# EAGLE design RC2014_UX_MODULE (EAGLE 6.6.0)
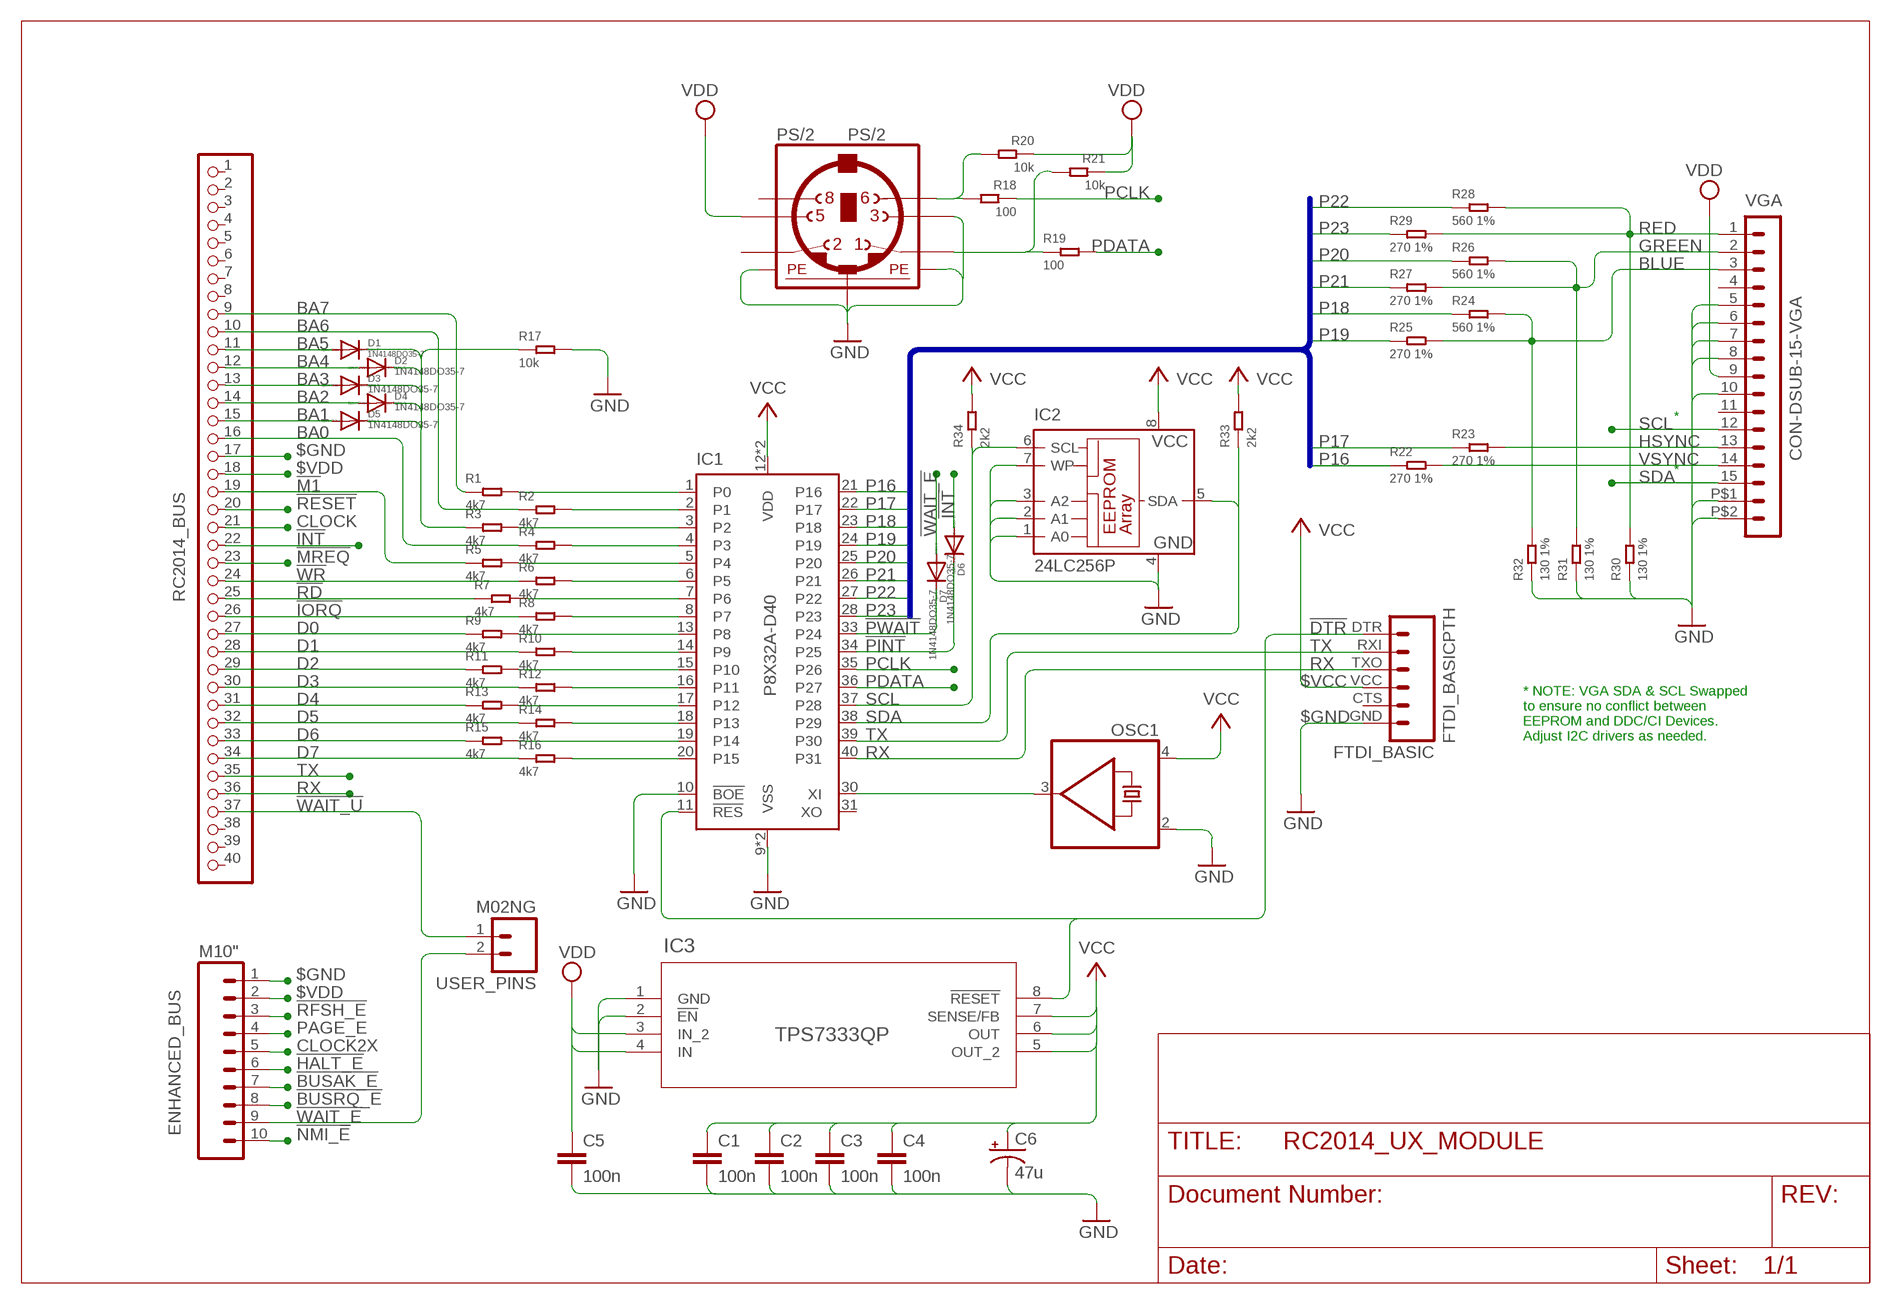
[diagram p0: schematic, sheet 1]

## Parts
C1  100n  C-EU025-025X050  [C025-025X050]
C2  100n  C-EU025-025X050  [C025-025X050]
C3  100n  C-EU025-025X050  [C025-025X050]
C4  100n  C-EU025-025X050  [C025-025X050]
C5  100n  C-EU025-025X050  [C025-025X050]
C6  47u  CAP_POLPTH1  [CPOL-RADIAL-100UF-25V]
D1  1N4148DO35-7  [DO35-7]
D2  1N4148DO35-7  [DO35-7]
D3  1N4148DO35-7  [DO35-7]
D4  1N4148DO35-7  [DO35-7]
D5  1N4148DO35-7  [DO35-7]
D6  1N4148DO35-7  [DO35-7]
D7  1N4148DO35-7  [DO35-7]
ENHANCED_BUS  M10"  [1X10]
FTDI_BASIC  FTDI_BASICPTH  [FTDI_BASIC]
IC1  P8X32A-D40  [DIL40]
IC2  24LC256P  [DIL8]
IC3  TPS7333QP  [P8_TEX]
OSC1  SG531  [DIL08-4]
PS/2  PS/2  MINI_DIN_6  [M_DIN6]
R1  4k7  RES-0207/7  [R0207_7]
R2  4k7  RES-0207/7  [R0207_7]
R3  4k7  RES-0207/7  [R0207_7]
R4  4k7  RES-0207/7  [R0207_7]
R5  4k7  RES-0207/7  [R0207_7]
R6  4k7  RES-0207/7  [R0207_7]
R7  4k7  RES-0207/7  [R0207_7]
R8  4k7  RES-0207/7  [R0207_7]
R9  4k7  RES-0207/7  [R0207_7]
R10  4k7  RES-0207/7  [R0207_7]
R11  4k7  RES-0207/7  [R0207_7]
R12  4k7  RES-0207/7  [R0207_7]
R13  4k7  RES-0207/7  [R0207_7]
R14  4k7  RES-0207/7  [R0207_7]
R15  4k7  RES-0207/7  [R0207_7]
R16  4k7  RES-0207/7  [R0207_7]
R17  10k  RES-0207/7  [R0207_7]
R18  100  RES-0207/7  [R0207_7]
R19  100  RES-0207/7  [R0207_7]
R20  10k  RES-0207/7  [R0207_7]
R21  10k  RES-0207/7  [R0207_7]
R22  270 1%  RES-0207/7  [R0207_7]
R23  270 1%  RES-0207/7  [R0207_7]
R24  560 1%  RES-0207/7  [R0207_7]
R25  270 1%  RES-0207/7  [R0207_7]
R26  560 1%  RES-0207/7  [R0207_7]
R27  270 1%  RES-0207/7  [R0207_7]
R28  560 1%  RES-0207/7  [R0207_7]
R29  270 1%  RES-0207/7  [R0207_7]
R30  130 1%  RES-0207/7  [R0207_7]
R31  130 1%  RES-0207/7  [R0207_7]
R32  130 1%  RES-0207/7  [R0207_7]
R33  2k2  RES-0207/7  [R0207_7]
R34  2k2  RES-0207/7  [R0207_7]
RC2014_BUS  RC2014 BUS  PINHD-1X40  [1X40]
USER_PINS  M02NG  [1X02]
VGA  CON-DSUB-15-VGA  [181-015-212-171]

## Nets
!BUSAK_E: ENHANCED_BUS.7
!BUSRQ_E: ENHANCED_BUS.8
!DTR: FTDI_BASIC.DTR IC1.11(!RES) IC3.8(!RESET)
!HALT_E: ENHANCED_BUS.6
!INT: D6.A RC2014_BUS.22
!IORQ: R8.1 RC2014_BUS.26
!M1: R5.1 RC2014_BUS.19
!MREQ: RC2014_BUS.23
!NMI_E: ENHANCED_BUS.10
!PINT: D6.C IC1.34(P25)
!PWAIT: D7.C IC1.33(P24)
!RD: R7.1 RC2014_BUS.25
!RESET: RC2014_BUS.20
!RFSH_E: ENHANCED_BUS.3
!WAIT_E: D7.A ENHANCED_BUS.9 USER_PINS.2
!WAIT_U: RC2014_BUS.37 USER_PINS.1
!WR: R6.1 RC2014_BUS.24
$GND: C1.2 C2.2 C3.2 C4.2 C5.2 C6.2(-) ENHANCED_BUS.1 FTDI_BASIC.GND IC1.9(VSS) IC1.10(!BOE) IC1.29(VSS) IC2.1(A0) IC2.2(A1) IC2.3(A2) IC2.4(GND) IC2.7(WP) IC3.1(GND) IC3.2(!EN) OSC1.2(GND) PS/2.3 PS/2.SH1(PE1) PS/2.SH2(PE2) PS/2.SH3(PE3) R17.2 R30.1 R31.1 R32.1 RC2014_BUS.17 VGA.5 VGA.6 VGA.7 VGA.8 VGA.10 VGA.P$1 VGA.P$2 ; supply symbol labelled GND
$VCC: C1.1 C2.1 C3.1 C4.1 C6.1(+) FTDI_BASIC.VCC IC1.12(VDD) IC1.32(VDD) IC2.8(VCC) IC3.5(OUT_2) IC3.6(OUT) IC3.7(SENSE/FB) OSC1.4(VCC) R33.2 R34.2 ; supply symbol labelled VCC
$VDD: C5.1 ENHANCED_BUS.2 IC3.3(IN_2) IC3.4(IN) PS/2.5 R20.1 R21.1 RC2014_BUS.18 VGA.9 ; supply symbol labelled VDD
BA0: R4.1 RC2014_BUS.16
BA1: D5.A RC2014_BUS.15
BA2: D4.A RC2014_BUS.14
BA3: D3.A RC2014_BUS.13
BA4: D2.A RC2014_BUS.12
BA5: D1.A RC2014_BUS.11
BA6: R2.1 RC2014_BUS.10
BA7: R1.1 RC2014_BUS.9
BLUE: R24.2 R25.2 R32.2 VGA.3
CLOCK: RC2014_BUS.21
CLOCK2X: ENHANCED_BUS.5
D0: R9.1 RC2014_BUS.27
D1: R10.1 RC2014_BUS.28
D2: R11.1 RC2014_BUS.29
D3: R12.1 RC2014_BUS.30
D4: R13.1 RC2014_BUS.31
D5: R14.1 RC2014_BUS.32
D6: R15.1 RC2014_BUS.33
D7: R16.1 RC2014_BUS.34
GREEN: R26.2 R27.2 R31.2 VGA.2
HSYNC: R23.2 VGA.13
KCLK: PS/2.6 R18.2 R20.2
KDATA: PS/2.1 R19.1 R21.2
N$1: IC1.13(P8) R9.2
N$2: IC1.14(P9) R10.2
N$3: IC1.15(P10) R11.2
N$4: IC1.16(P11) R12.2
N$5: IC1.17(P12) R13.2
N$6: IC1.18(P13) R14.2
N$7: IC1.19(P14) R15.2
N$8: IC1.20(P15) R16.2
N$9: IC1.8(P7) R8.2
N$10: IC1.7(P6) R7.2
N$11: IC1.6(P5) R6.2
N$12: IC1.5(P4) R5.2
N$13: IC1.4(P3) R4.2
N$14: IC1.3(P2) R3.2
N$15: IC1.2(P1) R2.2
N$16: IC1.1(P0) R1.2
N$19: D1.C D2.C D3.C D4.C D5.C R3.1 R17.1
N$20: IC1.30(XI) OSC1.3(OUT)
P16: IC1.21(P16) R22.1
P17: IC1.22(P17) R23.1
P18: IC1.23(P18) R24.1
P19: IC1.24(P19) R25.1
P20: IC1.25(P20) R26.1
P21: IC1.26(P21) R27.1
P22: IC1.27(P22) R28.1
P23: IC1.28(P23) R29.1
PAGE_E: ENHANCED_BUS.4
PCLK: IC1.35(P26) R18.1
PDATA: IC1.36(P27) R19.2
RED: R28.2 R29.2 R30.2 VGA.1
RX: FTDI_BASIC.TXO IC1.40(P31) RC2014_BUS.36
SCL: IC1.37(P28) IC2.6(SCL) R34.1 VGA.12
SDA: IC1.38(P29) IC2.5(SDA) R33.1 VGA.15
TX: FTDI_BASIC.RXI IC1.39(P30) RC2014_BUS.35
VSYNC: R22.2 VGA.14
Unconnected: FTDI_BASIC.CTS IC1.31(XO) PS/2.2 PS/2.8 RC2014_BUS.1 RC2014_BUS.2 RC2014_BUS.3 RC2014_BUS.4 RC2014_BUS.5 RC2014_BUS.6 RC2014_BUS.7 RC2014_BUS.8 RC2014_BUS.38 RC2014_BUS.39 RC2014_BUS.40 VGA.4 VGA.11

## Buses
P16,P17,P18,P19,P20,P21,P22,P23

## Notes on the sheet
- *
- *
- * NOTE: VGA SDA & SCL Swapped
  to ensure no conflict between
  EEPROM and DDC/CI Devices.
  Adjust I2C drivers as needed.

## Library data of the parts
C1-C5 = rcl:C-EU: CAPACITOR, European symbol
C6 = SparkFun:CAP_POL: Capacitor Polarized These are standard SMD and PTH capacitors. Normally 10uF, 47uF, and 100uF in electrolytic and tantalum varieties. Always verify the external diameter of the through hole cap, it varies with capacity, voltage, and manufacturer. The EIA devices should be standard.
D1-D7 = diode:1N4148: DIODE high speed (Philips)
ENHANCED_BUS = SparkFun:M10: Header 10 Standard 10-pin 0.1" header. Use with straight break away headers (SKU : PRT-00116), right angle break away headers (PRT-00553), swiss pins (PRT-00743), machine pins (PRT-00117), and female headers (PRT-00115).
FTDI_BASIC = SparkFun:FTDI_BASIC: FTDI Basic: 3.3V and 5V
IC1 = p8x32a_11:P8X32A-?: 8-Cog Multiprocessor Microcontroller Source: http://www.parallax.com/sites/default/files/downloads/P8X32A-Propeller-Datasheet-v1.4.0_0.pdf; MF: Parallax Semiconductor; MPN: P8X32A-D40; OC_FARNELL: 1263886; OC_NEWARK: 11X5686
IC2 = microchip:24*: Serial EEPROM I2C; MF: MICROCHIP; MPN: 24LC256-E/P; OC_FARNELL: 9757970; OC_NEWARK: 92C7169
IC3 = TPS7333:TPS7333QP; BUILT_BY: EMA_UL_Team; MANUFACTURER: Texas Instruments; MANUFACTURER_PART_NUMBER: TPS7333QP; SOURCELIBRARY: TI_2016-07-22; VENDOR: Texas Instruments
OSC1 = FX-Z180 Rev A:SG531: CRYSTAL RESONATOR
PS/2 = mini_din:MINI_DIN_6
R1-R34 = Seeed-OPL-Resistor-V2:RES
RC2014_BUS = pinhead:PINHD-1X40: PIN HEADER
USER_PINS = SparkFun:M02NG
VGA = m-pad-2.1:CON-DSUB-15-VGA: NORCOMP's High Density 90° PC Mount D-Sub Connector 181 Series: SPECIFICATIONS: Contact Rating: 5 Amps Dielectric Strength: 1000V AC RMS Insulation Resistance: 1000 meg ohms Contact Material: Phosphor Bronze Contact Finish: Gold flash over Nickel Operating Temperature: -55°C to 150°C Shell Material: Steel, Tin Plated Insulations Material: Glass-Filled Polyester (UL94V-0) Gender: Receptacle (female) Please send any comments to: messi@users.sourceforge.net

## Board
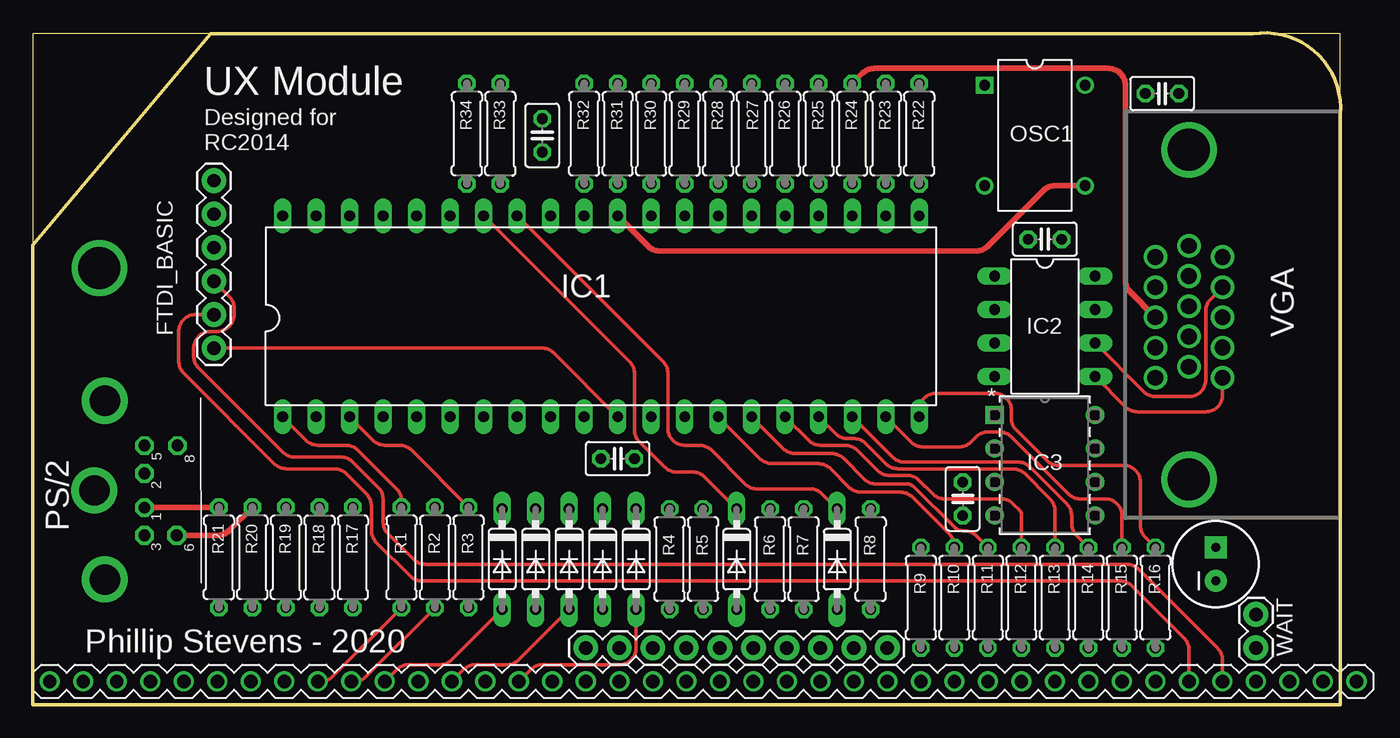
[diagram p1: board, top side]
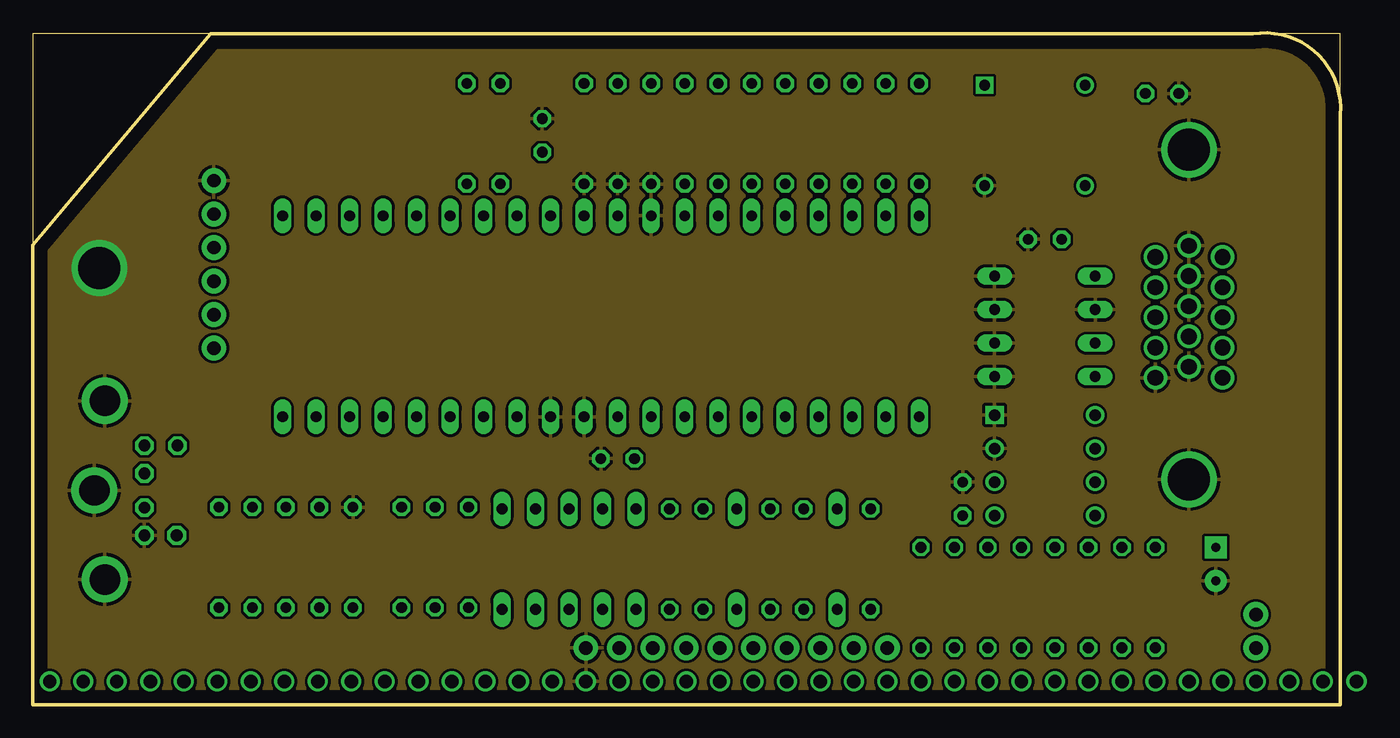
[diagram p2: board, inner layer GND]
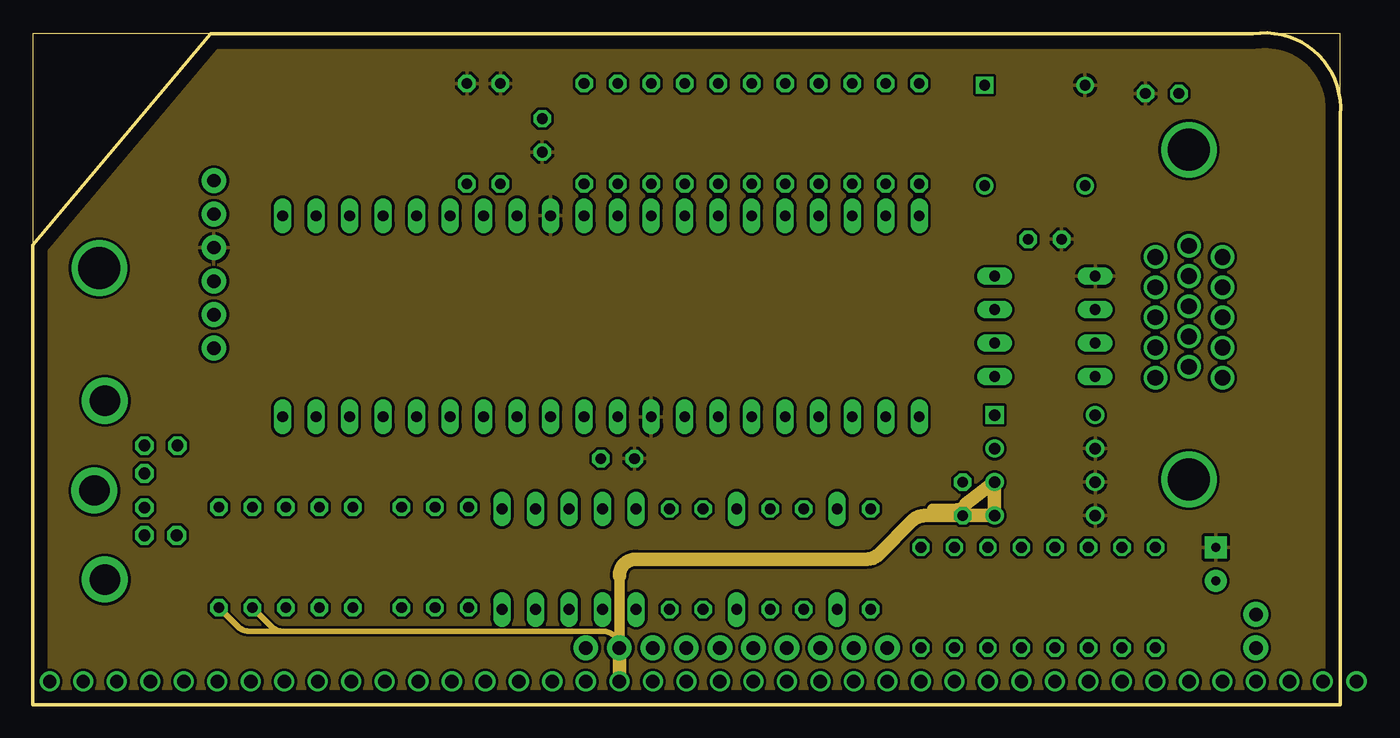
[diagram p3: board, inner layer VCC]
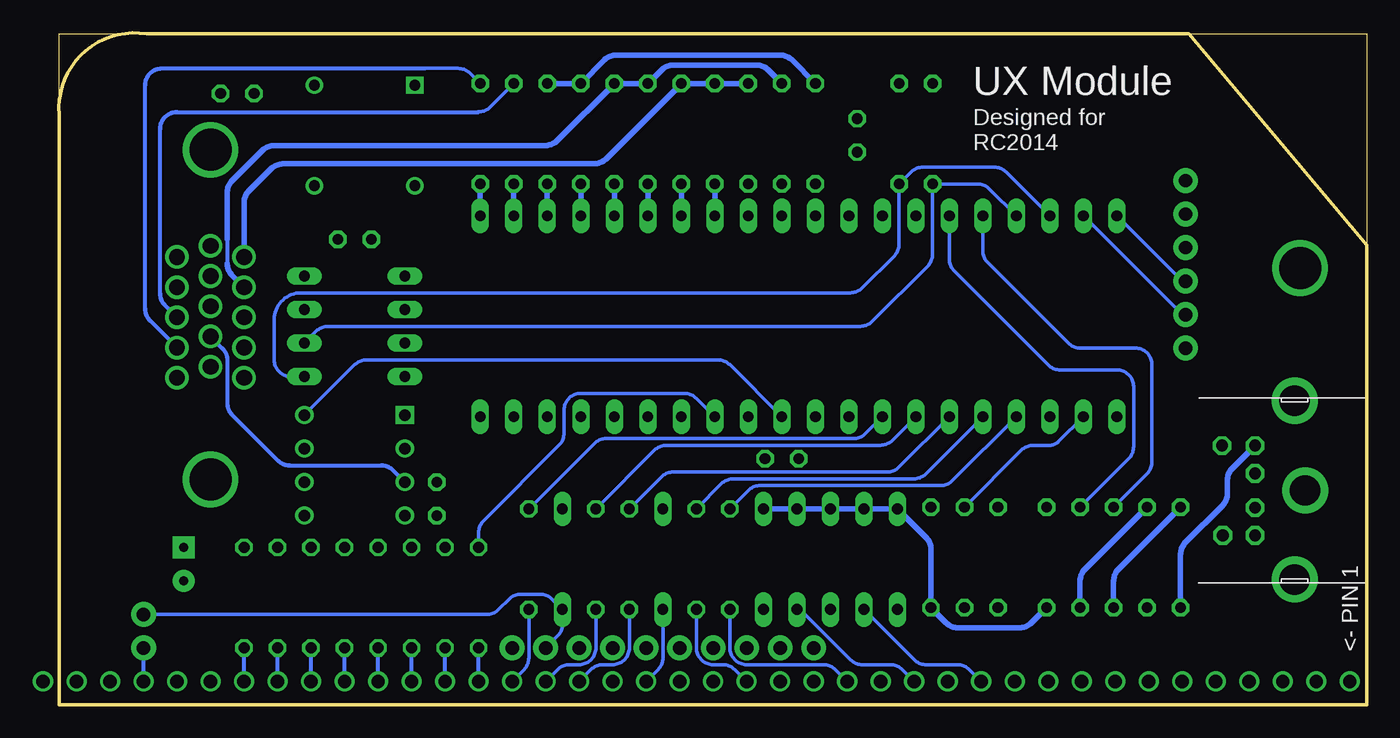
[diagram p4: board, bottom side, seen from below]

Size 99.13 x 50.95 mm. Coordinates in mm from the lower left corner, seen from the top.
Outline: 99.11,44.76 99.11,50.88 92.48,50.88
Outline: 13.49,50.88 0,50.88 0,34.85
Outline: 0,34.85 13.49,50.88
Outline: 92.48,50.88 arc-104 99.11,44.76
Outline: 13.49,50.88 92.48,50.88
Outline: 99.11,44.76 99.11,0 0,0 0,34.85
Copper layers (1*2*15*16): Top 0.035mm / dielectric 0.3mm / GND 0.035mm / dielectric 0.3mm / VCC 0.035mm / dielectric 0.3mm / Bottom 0.035mm
Design rules "default *": minimum track width 10mil, minimum drill 24mil, track to track 8mil, track to pad 8mil, pad to pad 8mil, via to via 8mil, smd to smd 8mil, copper to edge 40mil, drill to drill 8mil, minimum pad ring 10mil, minimum via ring 8mil, stop-mask expansion 4mil, vias tented up to drill 0mil, thermal gap 10mil

### Footprints (pad centres in the part's own frame; a part is rotated, then mirrored left to right if it is on the bottom)
C025-025X050 = drill 0.813 octagon: 1 -1.27,0; 2 1.27,0
CPOL-RADIAL-100UF-25V = drill 0.7 pad 1.651 square: 1 1.27,0 | drill 0.7 pad 1.651: 2 -1.27,0
DO35-7 = drill 0.813 long: A 3.81,0; C -3.81,0
1X10 = drill 1.016 pad 1.88: 1 0,0; 2 2.54,0; 3 5.08,0; 4 7.62,0; 5 10.16,0; 6 12.7,0; 7 15.24,0; 8 17.78,0; 9 20.32,0; 10 22.86,0
FTDI_BASIC = drill 1.016 pad 1.88: CTS 10.16,0; DTR 0,0; GND 12.7,0; RXI 2.54,0; TXO 5.08,0; VCC 7.62,0
DIL40 = drill 0.813 long: 1 -22.86,-7.62; 2 -20.32,-7.62; 3 -17.78,-7.62; 4 -15.24,-7.62; 5 -12.7,-7.62; 6 -10.16,-7.62; 7 -7.62,-7.62; 8 -5.08,-7.62; 9 -2.54,-7.62; 10 0,-7.62; 11 2.54,-7.62; 12 5.08,-7.62; 13 7.62,-7.62; 14 10.16,-7.62; 15 12.7,-7.62; 16 15.24,-7.62; 17 17.78,-7.62; 18 20.32,-7.62; 19 22.86,-7.62; 20 25.4,-7.62; 21 25.4,7.62; 22 22.86,7.62; 23 20.32,7.62; 24 17.78,7.62; 25 15.24,7.62; 26 12.7,7.62; 27 10.16,7.62; 28 7.62,7.62; 29 5.08,7.62; 30 2.54,7.62; 31 0,7.62; 32 -2.54,7.62; 33 -5.08,7.62; 34 -7.62,7.62; 35 -10.16,7.62; 36 -12.7,7.62; 37 -15.24,7.62; 38 -17.78,7.62; 39 -20.32,7.62; 40 -22.86,7.62
DIL8 = drill 0.813 long: 1 -3.81,-3.81; 2 -1.27,-3.81; 3 1.27,-3.81; 4 3.81,-3.81; 5 3.81,3.81; 6 1.27,3.81; 7 -1.27,3.81; 8 -3.81,3.81
P8_TEX = drill 0.864 pad 1.372 square: 1 0,0 | drill 0.864 pad 1.372: 2 0,-2.54; 3 0,-5.08; 4 0,-7.62; 5 7.62,-7.62; 6 7.62,-5.08; 7 7.62,-2.54; 8 7.62,0
DIL08-4 = drill 0.813 square: 1 -3.81,-3.81 | drill 0.813: 2 3.81,-3.81; 3 3.81,3.81; 4 -3.81,3.81
M_DIN6 = drill 0.9 pad 1.422 octagon: 1 -1.3,-3.75; 2 1.3,-3.75; 3 -3.4,-3.75; 5 3.4,-3.75; 6 -3.4,-6.2; 8 3.4,-6.25 | drill 2.3 pad 3.5: SH1 6.8,-0.75; SH2 0,0.05; SH3 -6.75,-0.75
R0207_7 = drill 0.813 octagon: 1 -3.81,0; 2 3.81,0
1X40 = drill 1.016: 1 -49.53,0; 2 -46.99,0; 3 -44.45,0; 4 -41.91,0; 5 -39.37,0; 6 -36.83,0; 7 -34.29,0; 8 -31.75,0; 9 -29.21,0; 10 -26.67,0; 11 -24.13,0; 12 -21.59,0; 13 -19.05,0; 14 -16.51,0; 15 -13.97,0; 16 -11.43,0; 17 -8.89,0; 18 -6.35,0; 19 -3.81,0; 20 -1.27,0; 21 1.27,0; 22 3.81,0; 23 6.35,0; 24 8.89,0; 25 11.43,0; 26 13.97,0; 27 16.51,0; 28 19.05,0; 29 21.59,0; 30 24.13,0; 31 26.67,0; 32 29.21,0; 33 31.75,0; 34 34.29,0; 35 36.83,0; 36 39.37,0; 37 41.91,0; 38 44.45,0; 39 46.99,0; 40 49.53,0
1X02 = drill 1.016 pad 1.88: 1 0,0; 2 2.54,0
181-015-212-171 = drill 1.194: 1 4.371,2.541; 2 2.08,2.541; 3 -0.211,2.541; 4 -2.502,2.541; 5 -4.793,2.541; 6 5.217,0; 7 2.926,0; 8 0.635,0; 9 -1.656,0; 10 -3.947,0; 11 4.371,-2.541; 12 2.08,-2.541; 13 -0.211,-2.541; 14 -2.502,-2.541; 15 -4.793,-2.541 | drill 3.2: P$1 -12.502,0; P$2 12.502,0

### Placement (x,y rotation side)
C1  44.32,18.67 180 top
C2  38.61,43.18 90 top
C3  76.71,35.31 180 top
C4  85.6,46.35 0 top
C5  70.48,15.62 90 top
C6  89.66,10.67 90 top
D1  35.56,11.05 270 top
D2  38.1,11.05 270 top
D3  40.64,11.05 270 top
D4  43.18,11.05 270 top
D5  45.72,11.05 270 top
D6  53.34,11.05 270 top
D7  60.96,11.05 270 top
ENHANCED_BUS  41.91,4.32 0 top
FTDI_BASIC  13.72,27.05 90 top
IC1  41.78,29.46 0 top
IC2  76.71,28.7 270 top
IC3  72.9,21.97 0 top
OSC1  75.95,43.18 270 top
PS/2  4.7,16.26 90 top
R1  27.94,11.18 90 top
R2  30.48,11.18 90 top
R3  33.02,11.18 90 top
R4  48.26,11.05 90 top
R5  50.8,11.05 90 top
R6  55.88,11.05 90 top
R7  58.42,11.05 90 top
R8  63.5,11.05 90 top
R9  67.31,8.13 90 top
R10  69.85,8.13 90 top
R11  72.39,8.13 90 top
R12  74.93,8.13 90 top
R13  77.47,8.13 90 top
R14  80.01,8.13 90 top
R15  82.55,8.13 90 top
R16  85.09,8.13 90 top
R17  24.26,11.18 90 top
R18  21.72,11.18 270 top
R19  19.18,11.18 90 top
R20  16.64,11.18 90 top
R21  14.1,11.18 90 top
R22  67.18,43.31 90 top
R23  64.64,43.31 90 top
R24  62.1,43.31 90 top
R25  59.56,43.31 90 top
R26  57.02,43.31 90 top
R27  54.48,43.31 90 top
R28  51.94,43.31 90 top
R29  49.4,43.31 90 top
R30  46.86,43.31 90 top
R31  44.32,43.31 90 top
R32  41.78,43.31 90 top
R33  35.43,43.31 90 top
R34  32.89,43.31 90 top
RC2014_BUS  50.8,1.78 0 top
USER_PINS  92.71,4.32 90 top
VGA  87.63,29.59 90 top

### Tracks (layer width: path | path; a pad name or v marks a point on that pad's centre or on a via)
!DTR
  Top 0.254: FTDI_BASIC.DTR 38.59,27.05 arc-45 39.49,26.68 IC1.11
  Bottom 0.254: IC3.8 76.7,25.79 arc45 75.8,26.16 49.17,26.16 arc45 48.27,25.79 IC1.11
!INT
  Bottom 0.254: D6.A 53.34,3.57 arc45 53.71,2.68 RC2014_BUS.22
!IORQ
  Bottom 0.254: R8.1 63.5,3.57 arc45 63.87,2.68 RC2014_BUS.26
!M1
  Bottom 0.254: R5.1 50.8,4.32 arc-90 49.53,3.05 48.79,3.05 arc45 47.89,2.68 RC2014_BUS.19
!PINT
  Top 0.254: D6.C 50.92,17.28 arc45 50.02,17.65 48.79,17.65 arc-45 47.89,18.02 45.97,19.95 arc-45 45.59,20.85 45.59,25.13 arc45 45.22,26.03 IC1.34
!PWAIT
  Top 0.254: D7.C 59.81,16.01 arc45 58.91,16.38 54.88,16.38 arc-45 53.98,16.75 51.43,19.31 arc45 50.53,19.68 49.4,19.68 arc-90 48.13,20.95 48.13,25.13 arc45 47.76,26.03 IC1.33
!RD
  Bottom 0.254: R7.1 58.42,4.32 arc90 59.69,3.05 60.43,3.05 arc-45 61.33,2.68 RC2014_BUS.25
!WAIT_E
  Bottom 0.254: ENHANCED_BUS.9 61.33,5.22 arc-45 60.96,6.11 D7.A 61.73,8.01 arc-45 62.63,8.38 64.12,8.38 arc-45 65.02,8.01 65.8,7.23 arc45 66.69,6.86 USER_PINS.2
!WAIT_U
  Bottom 0.305: RC2014_BUS.37 USER_PINS.1
!WR
  Bottom 0.254: R6.1 55.88,4.32 arc90 57.15,3.05 57.91,3.05 arc-45 58.78,2.69 RC2014_BUS.24
$GND  (via drill 3.2)
  other vias: 5.03,33.12
  pour GND: 13.46,50.8 92.58,50.93 arc-90 99.06,45.72 99.06,0 0,0 0,34.92
$VCC
  pour VCC: 13.46,50.93 93.34,50.93 arc-90 99.06,45.72 99.06,0 0,0 0,34.92
$VDD
  VCC 0.406: 18.94,5.59 16.4,5.59 arc-45 15.5,5.96 R21.1 | 18.94,5.59 43.18,5.59 arc-90 ENHANCED_BUS.2 | R20.1 18.04,5.96 arc45 18.94,5.59
  VCC 0.813: ENHANCED_BUS.2 44.45,9.78 | 70.73,15.23 arc-45 69.83,14.86 68.2,14.86 68.33,14.72 arc45 69.23,14.35 C5.1
  VCC 1.016: RC2014_BUS.18 ENHANCED_BUS.2 | 44.45,9.78 arc-90 45.72,11.05 63.23,11.05 arc45 64.13,11.42 66.68,13.98 arc-45 67.58,14.35 C5.1 IC3.4 IC3.3 70.73,15.23
  Bottom 0.305: VGA.9 86.73,27.04 arc45 86.36,26.14 86.36,22.88 arc-45 85.99,21.98 82.54,18.53 arc-45 81.64,18.16 74.69,18.16 arc45 73.8,17.79 IC3.3
  Bottom 0.406: R21.1 14.1,11.41 arc45 13.72,12.31 10.91,15.12 arc-45 10.54,16.02 10.54,17.04 arc45 10.17,17.94 PS/2.5
BA0
  Bottom 0.254: R4.1 48.26,4.32 arc-90 46.99,3.05 41.17,3.05 arc45 40.27,2.68 RC2014_BUS.16
BA1
  Top 0.254: D5.A 45.72,4.32 arc-90 44.45,3.05 38.63,3.05 arc45 37.73,2.68 RC2014_BUS.15
BA2
  Bottom 0.254: RC2014_BUS.14 35.19,2.68 arc-45 36.09,3.05 38.21,3.05 arc45 39.11,3.42 42.75,7.06 arc-45 D4.A
BA3
  Top 0.254: D3.A 36.82,3.42 arc-45 35.92,3.05 33.53,3.05 arc45 32.66,2.69 RC2014_BUS.13
BA4
  Bottom 0.254: D2.A 34.28,3.42 arc-45 33.38,3.05 31.01,3.05 arc45 30.11,2.68 RC2014_BUS.12
BA5
  Top 0.254: D1.A 31.74,3.42 arc-45 30.84,3.05 28.47,3.05 arc45 27.57,2.68 RC2014_BUS.11
BA6
  Top 0.254: R2.1 25.26,2.15 arc-45 24.37,1.78 RC2014_BUS.10
BA7
  Top 0.254: R1.1 22.72,2.15 arc-45 21.83,1.78 RC2014_BUS.9
BLUE
  Top 0.406: VGA.3 83.18,31.29 arc-45 82.8,32.19 82.8,46.99 arc90 81.53,48.26 63.77,48.26 arc45 62.87,47.89 R24.2
  Bottom 0.406: R24.2 R25.2 57.78,48.9 arc45 56.88,49.28 44.47,49.28 arc45 43.57,48.9 R32.2
D0
  Bottom 0.305: RC2014_BUS.27 R9.1
D1
  Bottom 0.305: RC2014_BUS.28 R10.1
D2
  Bottom 0.305: RC2014_BUS.29 R11.1
D3
  Bottom 0.305: RC2014_BUS.30 R12.1
D4
  Bottom 0.305: RC2014_BUS.31 R13.1
D5
  Bottom 0.305: RC2014_BUS.32 R14.1
D6
  Bottom 0.305: RC2014_BUS.33 R15.1
D7
  Bottom 0.305: RC2014_BUS.34 R16.1
GREEN
  Bottom 0.305: 86.36,35.31 86.36,33.47
  Bottom 0.406: VGA.2 85.99,32.57 arc45 86.36,33.47 | 86.36,35.31 86.36,38.84 arc45 85.99,39.74 83.68,42.05 arc45 82.79,42.42 62.25,42.42 arc-45 61.35,42.79 R26.2 R27.2 53.46,48.14 arc45 52.56,48.51 46.25,48.51 arc45 45.35,48.14 R31.2
HSYNC
  Bottom 0.254: 67.33,44.96 arc-45 66.43,45.33 R23.2
  Bottom 0.305: VGA.13 91.07,30.28 arc45 91.44,31.18 91.44,43.69 arc90 90.17,44.96 67.33,44.96
KCLK
  Top 0.406: R20.2 14.88,13.23 arc-45 13.98,12.86 PS/2.6
  Bottom 0.406: R18.2 21.72,9.38 arc45 21.34,10.28 R20.2
KDATA
  Top 0.406: R21.2 arc-45 14.03,14.96 PS/2.1
  Bottom 0.406: R19.1 19.18,9.38 arc45 18.8,10.28 R21.2
N$1
  Bottom 0.254: R9.2 67.31,13.06 arc45 66.94,13.96 61.2,19.69 arc-45 60.83,20.59 60.83,22.35 arc90 59.56,23.62 51.71,23.62 arc45 50.81,23.25 IC1.13
N$2
  Top 0.254: R10.2 69.85,12.05 arc45 69.48,12.95 66.67,15.76 arc45 65.77,16.13 62.76,16.13 arc-45 61.86,16.5 60.44,17.92 arc45 59.55,18.29 56.02,18.29 arc-45 55.13,18.66 IC1.14
N$3
  Top 0.254: R11.2 71.49,12.84 arc45 70.59,13.21 70.48,13.21 arc-45 69.83,13.48 66.79,16.52 arc45 66.2,16.76 63.9,16.76 arc-45 63,17.14 61.46,18.68 arc45 60.56,19.05 57.8,19.05 arc-45 56.91,19.42 IC1.15
N$4
  Top 0.254: R12.2 74.93,14.43 arc45 74.8,14.73 74.29,15.25 arc45 73.39,15.62 69.11,15.62 arc-45 68.21,15.99 67.17,17.03 arc45 66.28,17.4 64.92,17.4 arc-45 64.02,17.77 62.48,19.31 arc45 61.58,19.68 59.69,19.68 arc-45 58.82,20.04 IC1.16
N$5
  Top 0.254: R13.2 77.47,14.71 arc45 77.1,15.61 75.17,17.54 arc45 74.28,17.91 65.55,17.91 arc-45 64.65,18.28 63.11,19.82 arc45 62.21,20.19 61.72,20.19 arc-45 60.85,20.55 IC1.17
N$6
  Top 0.254: R14.2 79.11,12.84 arc-45 78.74,13.73 78.74,14.35 arc45 78.38,15.22 75.56,18.04 arc45 74.66,18.41 66.06,18.41 arc-45 65.16,18.79 IC1.18
N$7
  Top 0.254: R15.2 82.55,14.35 arc90 81.28,15.62 79.39,15.62 arc-45 78.5,15.99 74.16,20.33 arc45 73.26,20.7 72.39,20.7 arc45 71.52,20.34 71.11,19.93 arc-45 70.21,19.56 67.45,19.56 arc-45 66.56,19.93 IC1.19
N$8
  Top 0.254: R16.2 84.32,12.71 arc-45 83.95,13.61 83.95,16.89 arc90 82.68,18.16 77.74,18.16 arc-45 76.84,18.53 74.54,20.84 arc-45 74.17,21.73 74.17,22.35 arc90 72.9,23.62 68.45,23.62 arc90 67.18,22.35 IC1.20
N$9
  Bottom 0.254: R8.2 58.54,19.82 arc45 57.64,20.19 38.88,20.19 arc-45 37.98,20.57 IC1.8
N$10
  Bottom 0.254: R7.2 53.97,19.31 arc45 53.07,19.68 36.85,19.68 arc-45 35.95,20.06 IC1.7
N$11
  Bottom 0.254: R6.2 53.46,17.28 arc45 52.56,17.65 36.34,17.65 arc-45 35.44,18.02 IC1.6
N$12
  Bottom 0.254: R5.2 48.89,16.77 arc45 47.99,17.14 34.31,17.14 arc-45 33.41,17.52 IC1.5
N$13
  Bottom 0.254: R4.2 46.85,16.27 arc45 45.96,16.64 32.28,16.64 arc-45 31.38,17.01 IC1.4
N$14
  Top 0.254: R3.2 28.69,19.31 arc45 27.8,19.68 26.69,19.68 arc-45 25.79,20.06 IC1.3
N$15
  Bottom 0.254: R2.2 26.15,19.31 arc45 25.25,19.68 24,19.68 arc-45 23.35,19.95 IC1.2
N$16
  Top 0.254: R1.2 27.94,15.48 arc45 27.57,16.37 24.63,19.31 arc45 23.73,19.68 21.61,19.68 arc-45 20.71,20.06 IC1.1
N$19
  Bottom 0.406: D5.C D4.C D3.C D2.C D1.C 33.39,12.69 arc45 33.02,11.79 R3.1 31.87,6.21 arc-45 30.97,5.84 26.31,5.84 arc-45 25.41,6.21 R17.1
N$20
  Top 0.406: OSC1.3 77.49,39.37 arc45 76.59,39 72.38,34.79 arc-45 71.48,34.42 47.52,34.42 arc-45 46.62,34.79 IC1.30
P16
  Bottom 0.406: R22.1 IC1.21
P17
  Bottom 0.406: R23.1 IC1.22
P18
  Bottom 0.406: R24.1 IC1.23
P19
  Bottom 0.406: R25.1 IC1.24
P20
  Bottom 0.406: R26.1 IC1.25
P21
  Bottom 0.406: R27.1 IC1.26
P22
  Bottom 0.406: R28.1 IC1.27
P23
  Bottom 0.406: R29.1 IC1.28
PCLK
  Bottom 0.254: IC1.35 31.62,33.8 arc-45 31.25,32.9 24.12,25.77 arc-45 23.22,25.4 18.92,25.4 arc90 17.65,24.13 17.65,19.58 arc45 18.02,18.68 R18.1
PDATA
  Bottom 0.254: IC1.36 29.08,34.44 arc-45 28.71,33.54 22.6,27.42 arc-45 21.7,27.05 17.53,27.05 arc90 16.26,25.78 16.26,18.43 arc45 16.63,17.54 R19.2
RED
  Bottom 0.406: R30.2 R29.2 R28.2 57.67,41.39 arc45 58.56,41.02 82.15,41.02 arc-45 83.05,40.65 84.72,38.98 arc-45 85.09,38.08 VGA.1
RX
  Top 0.254: RC2014_BUS.36 90.17,3.41 arc45 89.8,4.31 83.81,10.3 arc45 82.91,10.67 29.74,10.67 arc-45 28.84,11.04 26.91,12.96 arc-45 26.54,13.86 26.54,15.6 arc45 26.17,16.5 24.25,18.42 arc45 23.35,18.8 19.83,18.8 arc-45 18.93,19.17 12.56,25.54 arc-45 12.19,26.43 12.19,27.05 arc-90 13.46,28.32 13.97,28.32 arc90 15.24,29.59 15.24,30.08 arc45 14.87,30.98 FTDI_BASIC.TXO
  Bottom 0.254: IC1.40 14.15,32.31 arc-45 FTDI_BASIC.TXO
SCL
  Top 0.254: IC2.6 84.21,23.74 arc45 85.11,23.37 87.63,23.37 arc90 88.9,24.64 88.9,29.87 arc-45 89.27,30.77 VGA.12
  Bottom 0.254: IC1.37 28.58,39.12 arc-45 29.48,39.5 R34.1 32.89,34.18 arc45 33.27,33.28 37.47,29.07 arc45 38.37,28.7 78.72,28.7 arc-45 79.62,28.33 IC2.6
SDA
  Top 0.254: IC2.5 82.81,22.6 arc45 83.71,22.23 88.9,22.23 arc90 90.17,23.5 VGA.15
  Bottom 0.254: IC1.38 27.31,40.4 arc-45 28.21,40.77 33.64,40.77 arc-45 34.53,40.4 R33.1 35.43,34.94 arc45 35.8,34.05 38.24,31.61 arc45 39.13,31.24 80.77,31.24 arc-90 82.8,29.21 82.8,26.16 arc-90 81.53,24.89 IC2.5
TX
  Top 0.254: RC2014_BUS.35 87.63,4.17 arc45 87.26,5.07 83.3,9.03 arc45 82.41,9.4 29.48,9.4 arc-45 28.58,9.77 26.03,12.33 arc-45 25.65,13.23 25.65,15.1 arc45 25.28,15.99 23.74,17.54 arc45 22.84,17.91 19.2,17.91 arc-45 18.3,18.28 11.42,25.16 arc-45 11.05,26.05 11.05,28.32 arc-90 12.32,29.59 FTDI_BASIC.RXI
  Bottom 0.254: IC1.39 14.15,29.77 arc-45 FTDI_BASIC.RXI
VSYNC
  Bottom 0.254: R22.2 67.95,47.89 arc-45 68.85,48.26 71.39,48.26
  Bottom 0.305: VGA.14 92.21,29.13 arc45 92.58,30.03 92.58,46.99 arc90 91.31,48.26 71.39,48.26

### Text on the board
tPlace: UX Module | Designed for / RC2014 | Phillip Stevens - 2020 | WAIT
bPlace: UX Module | Designed for / RC2014 | <- PIN 1